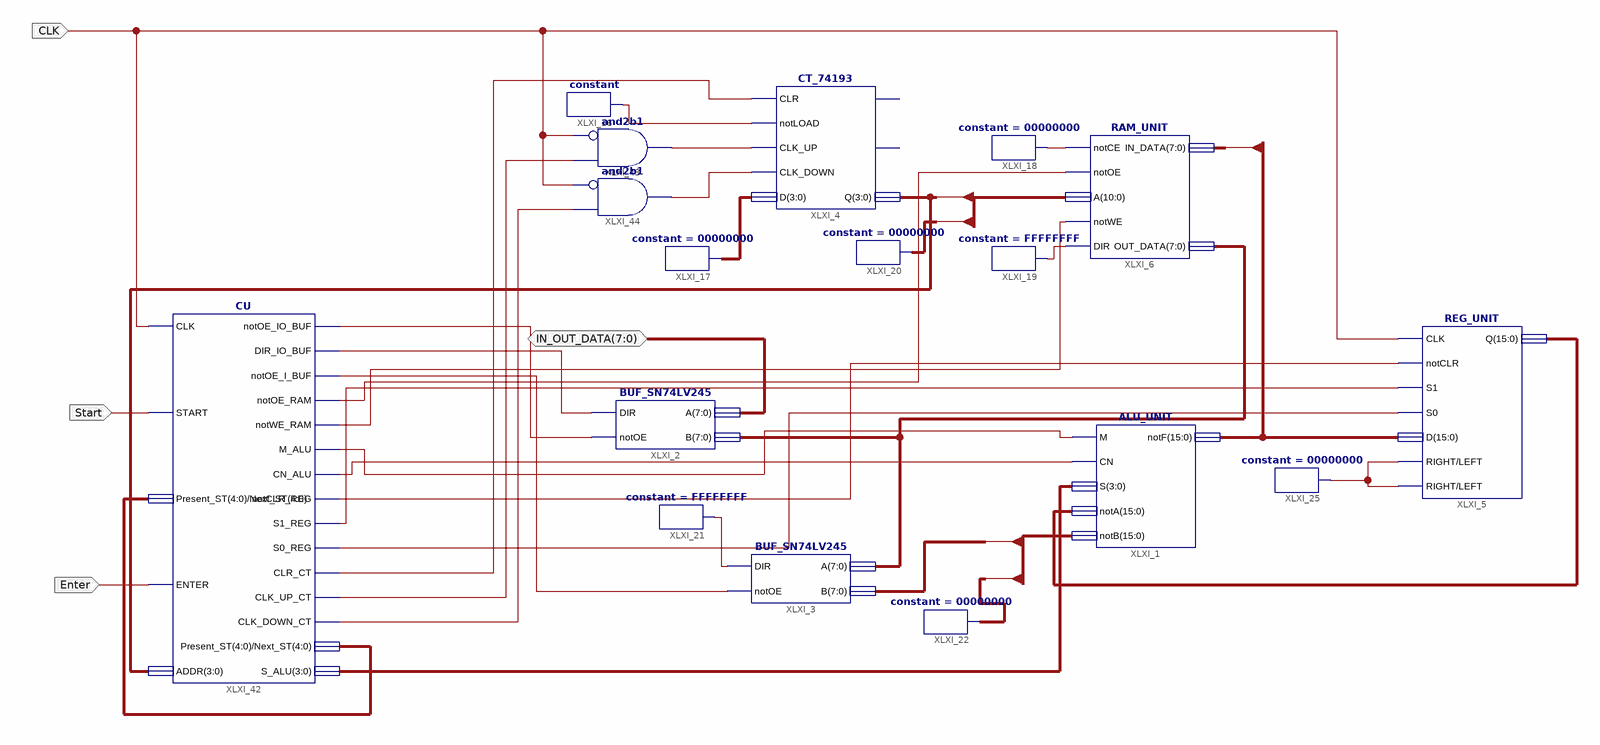
[diagram p0: schematic sheet 1]
// Xilinx ISE schematic OperationUnit.sch (spartan3a) as structural Verilog: 17 symbols, 4 ports
module OperationUnit (
  input  CLK,
  input  Enter,
  input  Start,
  inout  [7:0] IN_OUT_DATA
);

  wire CLK_DOWN, CLK_DOWN_CT, CLK_UP, CLK_UP_CT, CLR_CT, CN_ALU, DIR_I_BUF, DIR_IO_BUF, DIR_RAM, M_ALU,
       notCE_RAM, notCLR_REG, notLOAD, notOE_IN_BUF, notOE_IO_BUF, notOE_RAM, notWE_RAM, S0_REG, S1_REG,
       XLXN_16;
  wire [3:0] D_CT, S_ALU;
  wire [4:0] XLXN_108;
  wire [7:0] XLXN_130;
  wire [10:0] A;
  wire [15:0] notA_ALU, notB_ALU, OUT_ALU;

  ALU_UNIT XLXI_1 (.M(M_ALU), .CN(CN_ALU), .S(S_ALU), .notA(notA_ALU), .notB(notB_ALU), .notF(OUT_ALU));
  REG_UNIT XLXI_5 (
    .CLK(CLK), .notCLR(notCLR_REG), .S1(S1_REG), .S0(S0_REG), .D(OUT_ALU), .RIGHT(XLXN_16), .LEFT(XLXN_16),
    .Q(notA_ALU));
  BUF_SN74LV245 XLXI_2 (.DIR(DIR_IO_BUF), .notOE(notOE_IO_BUF), .A(IN_OUT_DATA), .B(XLXN_130));
  CT_74193 XLXI_4 (
    .CLR(CLR_CT), .notLOAD(notLOAD), .CLK_UP(CLK_UP), .CLK_DOWN(CLK_DOWN), .D(D_CT), .Q(A[3:0]));  // open: G15, L0
  RAM_UNIT XLXI_6 (
    .notCE(notCE_RAM), .notOE(notOE_RAM), .A(A), .notWE(notWE_RAM), .DIR(DIR_RAM), .OUT_DATA(XLXN_130),
    .IN_DATA(OUT_ALU[7:0]));
  constant XLXI_16 (.O(notLOAD));
  constant #(.CValue("00000000")) XLXI_17 (.O(D_CT));
  constant #(.CValue("00000000")) XLXI_18 (.O(notCE_RAM));
  constant #(.CValue("FFFFFFFF")) XLXI_19 (.O(DIR_RAM));
  constant #(.CValue("00000000")) XLXI_20 (.O(A[10:4]));
  constant #(.CValue("00000000")) XLXI_22 (.O(notB_ALU[15:8]));
  constant #(.CValue("FFFFFFFF")) XLXI_21 (.O(DIR_I_BUF));
  BUF_SN74LV245 XLXI_3 (.DIR(DIR_I_BUF), .notOE(notOE_IN_BUF), .A(XLXN_130), .B(notB_ALU[7:0]));
  constant #(.CValue("00000000")) XLXI_25 (.O(XLXN_16));
  CU XLXI_42 (
    .CLK(CLK), .START(Start), .Present_ST(XLXN_108), .ENTER(Enter), .ADDR(A[3:0]),
    .notOE_IO_BUF(notOE_IO_BUF), .DIR_IO_BUF(DIR_IO_BUF), .notOE_I_BUF(notOE_IN_BUF), .notOE_RAM(notOE_RAM),
    .notWE_RAM(notWE_RAM), .M_ALU(M_ALU), .CN_ALU(CN_ALU), .notCLR_REG(notCLR_REG), .S1_REG(S1_REG),
    .S0_REG(S0_REG), .CLR_CT(CLR_CT), .CLK_UP_CT(CLK_UP_CT), .CLK_DOWN_CT(CLK_DOWN_CT), .Next_ST(XLXN_108),
    .S_ALU(S_ALU));
  and XLXI_43 (CLK_UP, ~CLK, CLK_UP_CT);  // and2b1
  and XLXI_44 (CLK_DOWN, ~CLK, CLK_DOWN_CT);  // and2b1
endmodule
